# EAGLE design Human Harp Player (EAGLE 7.1.0)
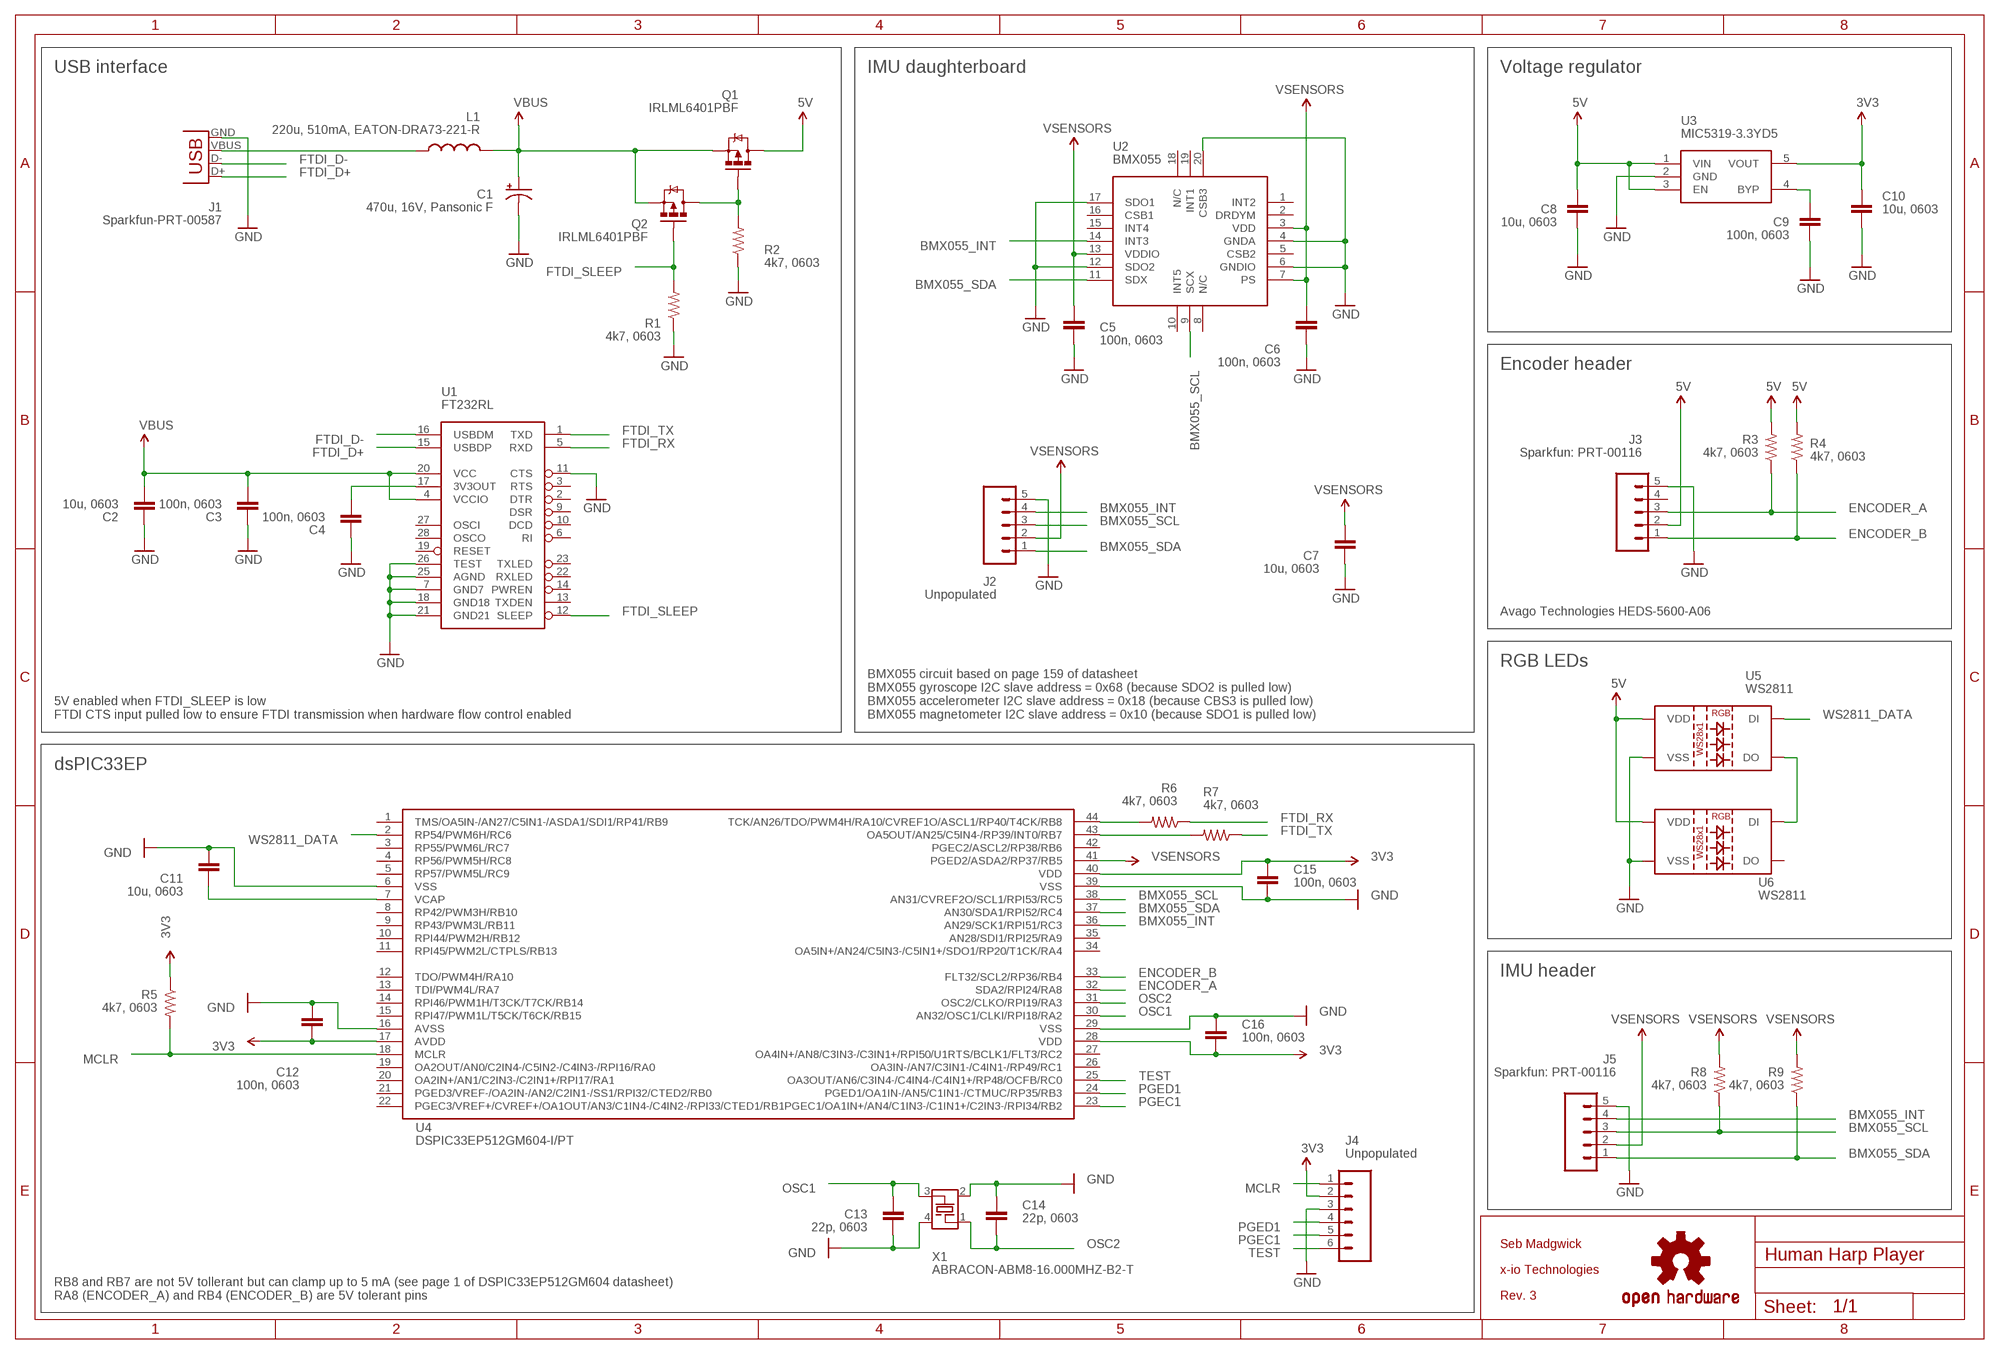
[diagram p0: schematic, sheet 1]

## Parts
C1  470u, 16V, Pansonic F  CPOL-USF  [PANASONIC_F]
C2  10u, 0603  CAP0402-CAP  [0402-CAP]
C3  100n, 0603  CAP0402-CAP  [0402-CAP]
C4  100n, 0603  CAP0402-CAP  [0402-CAP]
C5  100n, 0603  CAP0402-CAP  [0402-CAP]
C6  100n, 0603  CAP0402-CAP  [0402-CAP]
C7  10u, 0603  CAP0402-CAP  [0402-CAP]
C8  10u, 0603  CAP0402-CAP  [0402-CAP]
C9  100n, 0603  CAP0402-CAP  [0402-CAP]
C10  10u, 0603  CAP0402-CAP  [0402-CAP]
C11  10u, 0603  CAP0402-CAP  [0402-CAP]
C12  100n, 0603  CAP0402-CAP  [0402-CAP]
C13  22p, 0603  CAP0402-CAP  [0402-CAP]
C14  22p, 0603  CAP0402-CAP  [0402-CAP]
C15  100n, 0603  CAP0402-CAP  [0402-CAP]
C16  100n, 0603  CAP0402-CAP  [0402-CAP]
J1  Sparkfun-PRT-00587  USBSMD  [USB-MINIB]
J2  Unpopulated  M05PTH  [1X05]
J3  Sparkfun: PRT-00116  M05PTH  [1X05]
J4  Unpopulated  M06NO_SILK  [1X06_NO_SILK]
J5  Sparkfun: PRT-00116  M05PTH  [1X05]
L1  220u, 510mA, EATON-DRA73-221-R  L-USPIS2816  [PIS2816]
LOGO1  OSHW-LOGOL  [OSHW-LOGO-L]
Q1  IRLML6401PBF  MOSFET-PCHANNEL  [SOT23-3]
Q2  IRLML6401PBF  MOSFET-PCHANNEL  [SOT23-3]
R1  4k7, 0603  RESISTOR0402-RES  [0402-RES]
R2  4k7, 0603  RESISTOR0402-RES  [0402-RES]
R3  4k7, 0603  RESISTOR0402-RES  [0402-RES]
R4  4k7, 0603  RESISTOR0402-RES  [0402-RES]
R5  4k7, 0603  RESISTOR0402-RES  [0402-RES]
R6  4k7, 0603  RESISTOR0402-RES  [0402-RES]
R7  4k7, 0603  RESISTOR0402-RES  [0402-RES]
R8  4k7, 0603  RESISTOR0402-RES  [0402-RES]
R9  4k7, 0603  RESISTOR0402-RES  [0402-RES]
U1  FT232RL  FT232RLSSOP  [SSOP28DB]
U2  BMX055  [BMX055]
U3  MIC5319-3.3YD5  MIC5319  [SOT23-5]
U4  DSPIC33EP512GM604-I/PT  DSPIC33EP512GM604  [TQFP44]
U5  WS2811  LED-TRICOLOR-5050-ICWS2811  [LED-TRICOLOR-5050-IC]
U6  WS2811  LED-TRICOLOR-5050-ICWS2811  [LED-TRICOLOR-5050-IC]
X1  ABRACON-ABM8-16.000MHZ-B2-T  ABM8  [ABM8]

## Nets
3V3: C10.1 C12.1 C15.1 C16.2 J4.2 R5.1 U3.5(VOUT) U4.17(AVDD) U4.28(VDD) U4.40(VDD)
5V: C8.1 J3.2 Q1.3(D) R3.2 R4.2 U3.1(VIN) U3.3(EN) U5.3(VDD) U5.5(VDD) U6.3(VDD) U6.5(VDD)
BMX055_INT: J2.4 J5.4 U2.14(INT3) U4.36(AN29/SCK1/RPI51/RC3)
BMX055_SCL: J2.3 J5.3 R8.1 U2.9(SCX) U4.38(AN31/CVREF2O/SCL1/RPI53/RC5)
BMX055_SDA: J2.1 J5.1 R9.1 U2.11(SDX) U4.37(AN30/SDA1/RPI52/RC4)
ENCODER_A: J3.3 R3.1 U4.32(SDA2/RPI24/RA8)
ENCODER_B: J3.1 R4.1 U4.33(FLT32/SCL2/RP36/RB4)
FTDI_D+: J1.D+ U1.15(USBDP)
FTDI_D-: J1.D- U1.16(USBDM)
FTDI_RX: R6.1 U1.5(RXD)
FTDI_SLEEP: Q2.1(G) R1.2 U1.12(SLEEP)
FTDI_TX: R7.1 U1.1(TXD)
GND: C1.- C2.1 C3.1 C4.1 C5.2 C6.2 C7.1 C8.2 C9.2 C10.2 C11.2 C12.2 C13.1 C14.1 C15.2 C16.1 J1.GND J2.5 J3.5 J4.3 J5.5 R1.1 R2.1 U1.7(GND7) U1.11(CTS) U1.18(GND18) U1.21(GND21) U1.25(AGND) U1.26(TEST) U2.4(GNDA) U2.6(GNDIO) U2.12(SDO2) U2.17(SDO1) U2.20(CSB3) U3.2(GND) U4.6(VSS) U4.16(AVSS) U4.29(VSS) U4.39(VSS) U5.6(VSS) U6.6(VSS) X1.2 X1.4
MCLR: J4.1 R5.2 U4.18(MCLR)
N$1: Q1.1(G) Q2.3(D) R2.2
N$2: R6.2 U4.44(TCK/AN26/TDO/PWM4H/RA10/CVREF1O/ASCL1/RP40/T4CK/RB8)
N$3: C4.2 U1.17(3V3OUT)
N$4: C11.1 U4.7(VCAP)
N$5: R7.2 U4.43(OA5OUT/AN25/C5IN4-/RP39/INT0/RB7)
N$6: J1.VBUS L1.1
N$7: C9.1 U3.4(BYP)
N$8: U5.1(DO) U6.2(DI)
OSC1: C13.2 U4.30(AN32/OSC1/CLKI/RPI18/RA2) X1.3
OSC2: C14.2 U4.31(OSC2/CLKO/RPI19/RA3) X1.1
PGEC1: J4.5 U4.23(PGEC1/OA1IN+/AN4/C1IN3-/C1IN1+/C2IN3-/RPI34/RB2)
PGED1: J4.4 U4.24(PGED1/OA1IN-/AN5/C1IN1-/CTMUC/RP35/RB3)
TEST: J4.6 U4.25(OA3OUT/AN6/C3IN4-/C4IN4-/C4IN1+/RP48/OCFB/RC0)
VBUS: C1.+ C2.2 C3.2 L1.2 Q1.2(S) Q2.2(S) U1.4(VCCIO) U1.20(VCC)
VSENSORS: C5.1 C6.1 C7.2 J2.2 J5.2 R8.2 R9.2 U2.3(VDD) U2.7(PS) U2.13(VDDIO) U4.41(PGED2/ASDA2/RP37/RB5)
WS2811_DATA: U4.2(RP54/PWM6H/RC6) U5.2(DI)
Unconnected: J3.4 U1.2(DTR) U1.3(RTS) U1.6(RI) U1.9(DSR) U1.10(DCD) U1.13(TXDEN) U1.14(PWREN) U1.19(RESET) U1.22(RXLED) U1.23(TXLED) U1.27(OSCI) U1.28(OSCO) U2.1(INT2) U2.2(DRDYM) U2.5(CSB2) U2.8(N/C) U2.10(INT5) U2.15(INT4) U2.16(CSB1) U2.18(N/C) U2.19(INT1) U4.1(TMS/OA5IN-/AN27/C5IN1-/ASDA1/SDI1/RP41/RB9) U4.3(RP55/PWM6L/RC7) U4.4(RP56/PWM5H/RC8) U4.5(RP57/PWM5L/RC9) U4.8(RP42/PWM3H/RB10) U4.9(RP43/PWM3L/RB11) U4.10(RPI44/PWM2H/RB12) U4.11(RPI45/PWM2L/CTPLS/RB13) U4.12(TDO/PWM4H/RA10) U4.13(TDI/PWM4L/RA7) U4.14(RPI46/PWM1H/T3CK/T7CK/RB14) U4.15(RPI47/PWM1L/T5CK/T6CK/RB15) U4.19(OA2OUT/AN0/C2IN4-/C5IN2-/C4IN3-/RPI16/RA0) U4.20(OA2IN+/AN1/C2IN3-/C2IN1+/RPI17/RA1) U4.21(PGED3/VREF-/OA2IN-/AN2/C2IN1-/SS1/RPI32/CTED2/RB0) U4.22(PGEC3/VREF+/CVREF+/OA1OUT/AN3/C1IN4-/C4IN2-/RPI33/CTED1/RB1) U4.26(OA3IN-/AN7/C3IN1-/C4IN1-/RP49/RC1) U4.27(OA4IN+/AN8/C3IN3-/C3IN1+/RPI50/U1RTS/BCLK1/FLT3/RC2) U4.34(OA5IN+/AN24/C5IN3-/C5IN1+/SDO1/RP20/T1CK/RA4) U4.35(AN28/SDI1/RPI25/RA9) U4.42(PGEC2/ASCL2/RP38/RB6) U6.1(DO)

## Notes on the sheet
- USB interface | IMU daughterboard | Voltage regulator
- Encoder header
- Avago Technologies HEDS-5600-A06
- RGB LEDs
- 5V enabled when FTDI_SLEEP is low
  FTDI CTS input pulled low to ensure FTDI transmission when hardware flow control enabled
- BMX055 circuit based on page 159 of datasheet
  BMX055 gyroscope I2C slave address = 0x68 (because SDO2 is pulled low)
  BMX055 accelerometer I2C slave address = 0x18 (because CBS3 is pulled low)
  BMX055 magnetometer I2C slave address = 0x10 (because SDO1 is pulled low)
- dsPIC33EP
- IMU header
- Seb Madgwick
- x-io Technologies
- RB8 and RB7 are not 5V tollerant but can clamp up to 5 mA (see page 1 of DSPIC33EP512GM604 datasheet)
  RA8 (ENCODER_A) and RB4 (ENCODER_B) are 5V tolerant pins
- Rev. 3

## Library data of the parts
C1 = rcl:CPOL-US: POLARIZED CAPACITOR, American symbol
C2-C16 = SparkFun:CAP: Capacitor Standard 0603 ceramic capacitor, and 0.1" leaded capacitor.
J1 = SparkFun-Connectors:USB: USB Connectors USB-B-PTH is fully proven SKU : PRT-00139/CONN-08278 USB-miniB is fully proven SKU : PRT-00587 USB-A-PCB is untested. USB-A-H is throughly reviewed, but untested. Spark Fun Electronics SKU : PRT-00437 USB-B-SMT is throughly reviewed, but untested. Needs silkscreen touching up. USB-A-S has not been used/tested USB-MB-H has not been used/tested USB-MICROB has been used. CONN-09505; PROD_ID: CONN-08193
J2 J3 J5 = SparkFun-Connectors:M05: Header 5 Standard 5-pin 0.1" header. Use with straight break away headers (SKU : PRT-00116), right angle break away headers (PRT-00553), swiss pins (PRT-00743), machine pins (PRT-00117), and female headers (PRT-00115). Molex polarized connector foot print use with SKU : PRT-08230 with associated crimp pins and housings.
J4 = SparkFun-Connectors:M06: Header 6 Standard 6-pin 0.1" header. Use with straight break away headers (SKU : PRT-00116), right angle break away headers (PRT-00553), swiss pins (PRT-00743), machine pins (PRT-00117), and female headers (PRT-00115). Molex polarized connector foot print use with SKU : PRT-08094 with associated crimp pins and housings. NOTES ON THE VARIANTS LOCK and LOCK_LONGPADS... This footprint was designed to help hold the alignment of a through-hole component (i.e. 6-pin header) while soldering it into place. You may notice that each hole has been shifted either up or down by 0.005 of an inch from it's more standard position (which is a perfectly straight line). This slight alteration caused the pins (the squares in the middle) to touch the edges of the holes. Because they are alternating, it causes a "brace" to hold the component in place. 0.005 has proven to be the perfect amount of "off-center" position when using our standard breakaway headers. Although looks a little odd when you look at the bare footprint, once you have a header in there, the alteration is very hard to notice. Also,if you push a header all the way into place, it is covered up entirely on the bottom side. This idea of altering the position of holes to aid alignment will be further integrated into the Sparkfun Library for other footprints. It can help hold any component with 3 or more connection pins.
L1 = rcl:L-US: INDUCTOR, American symbol
LOGO1 = SparkFun-Aesthetics:OSHW-LOGO: Open Source Hardware Logo This logo indicates the piece of hardware it is found on incorporates a OSHW license and/or adheres to the definition of open source hardware found here: http://freedomdefined.org/OSHW
Q1 Q2 = SparkFun-DiscreteSemi:MOSFET-PCHANNEL: Generic PMOSFET IRLML2244 - TRANS-11153 (SOT-23 -20V -4.3A) (1.Gate 2.Source 3.Drain) FQP27P06 - COM-10349 <http://www.sparkfun.com/products/10349> (TO-220 -60V -27A) (1.Gate 2.Source 3.Drain); PROD_ID: TRANS-08285
R1-R9 = SparkFun:RESISTOR: Resistor Basic schematic elements and footprints for 0603, 1206, and PTH 1/10th watt (small) resistors.
U1 = SparkFun:FT232RL: USB UART FT232RL 4th Generation USB UART (USB <-> Serial) Controller. Spark Fun Electronics SKU : COM-00650
U2 = x-io:BMX055
U3 = x-io:MIC5319
U4 = x-io:DSPIC33EP512GM604
U5 U6 = SparkFun-LED:LED-TRICOLOR-5050-IC: WS2812 RGB LED w/ WS2811 driver 5x5mm SMD LED with built-in controller IC. DIO-11598; PROD_ID: DIO-11598
X1 = x-io:ABM8

## Board
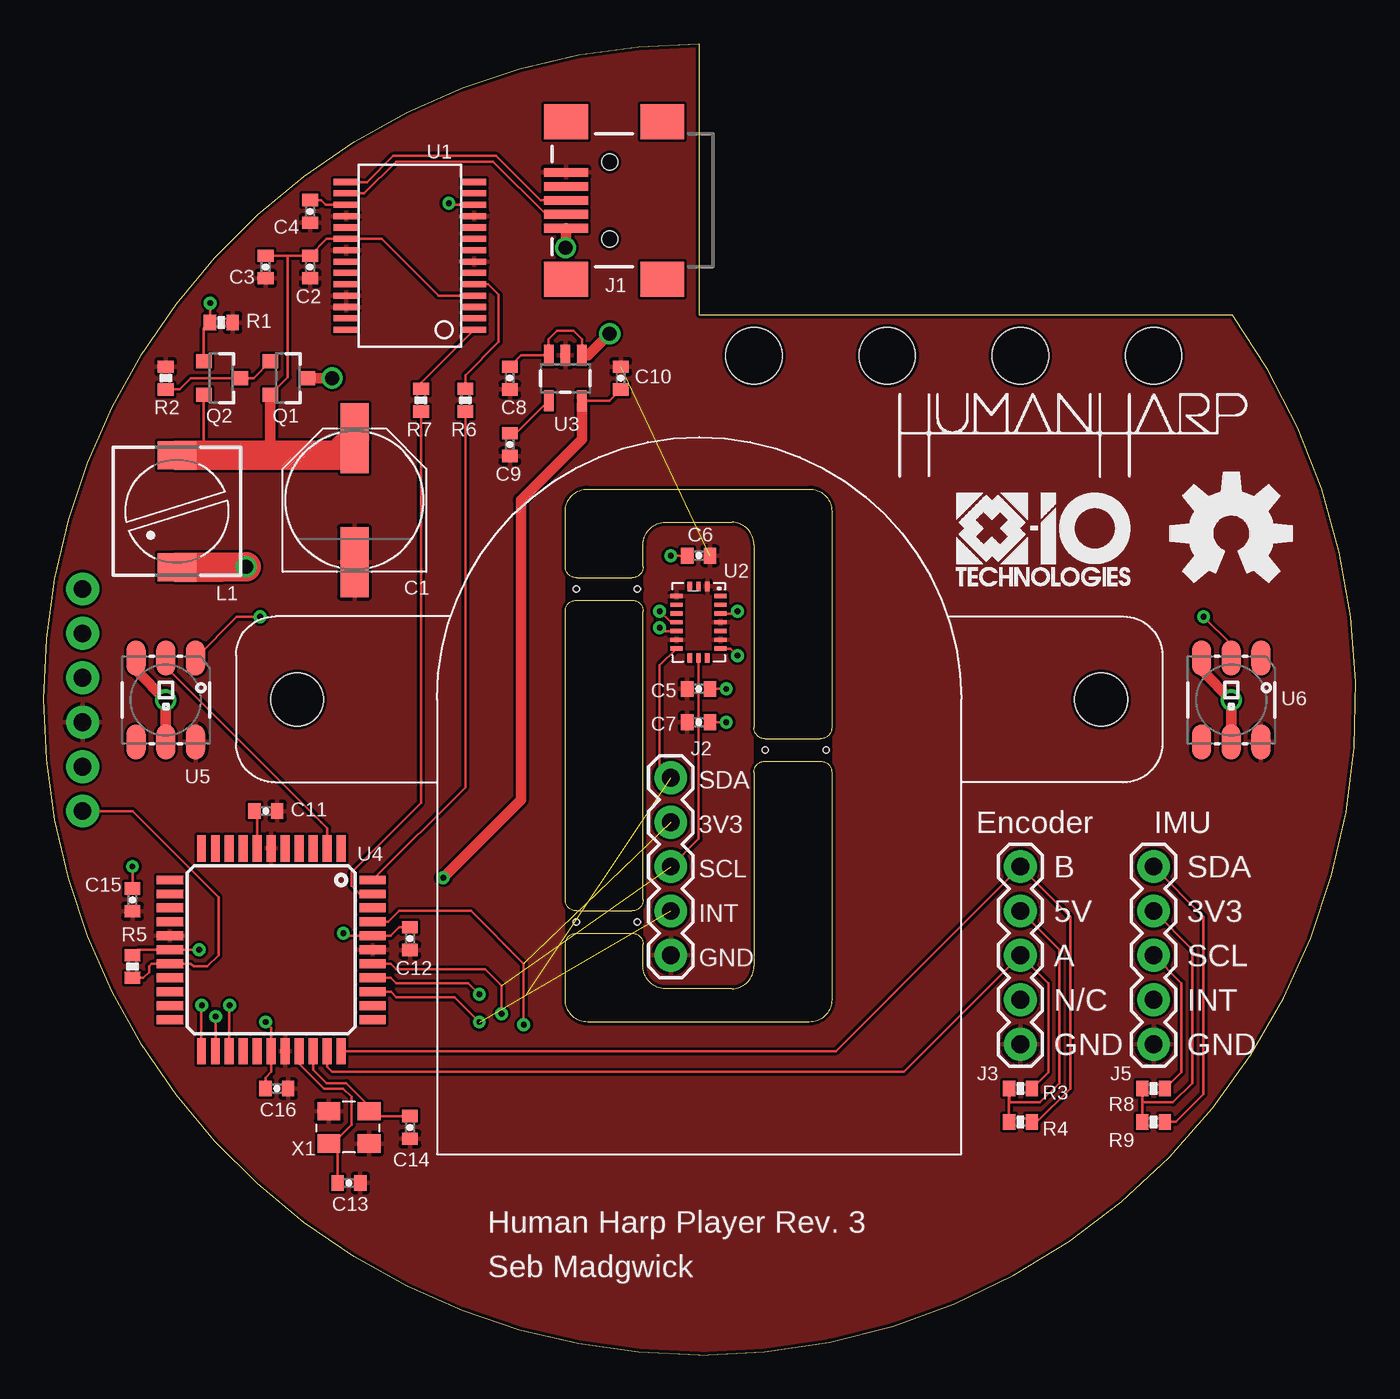
[diagram p1: board, top side]
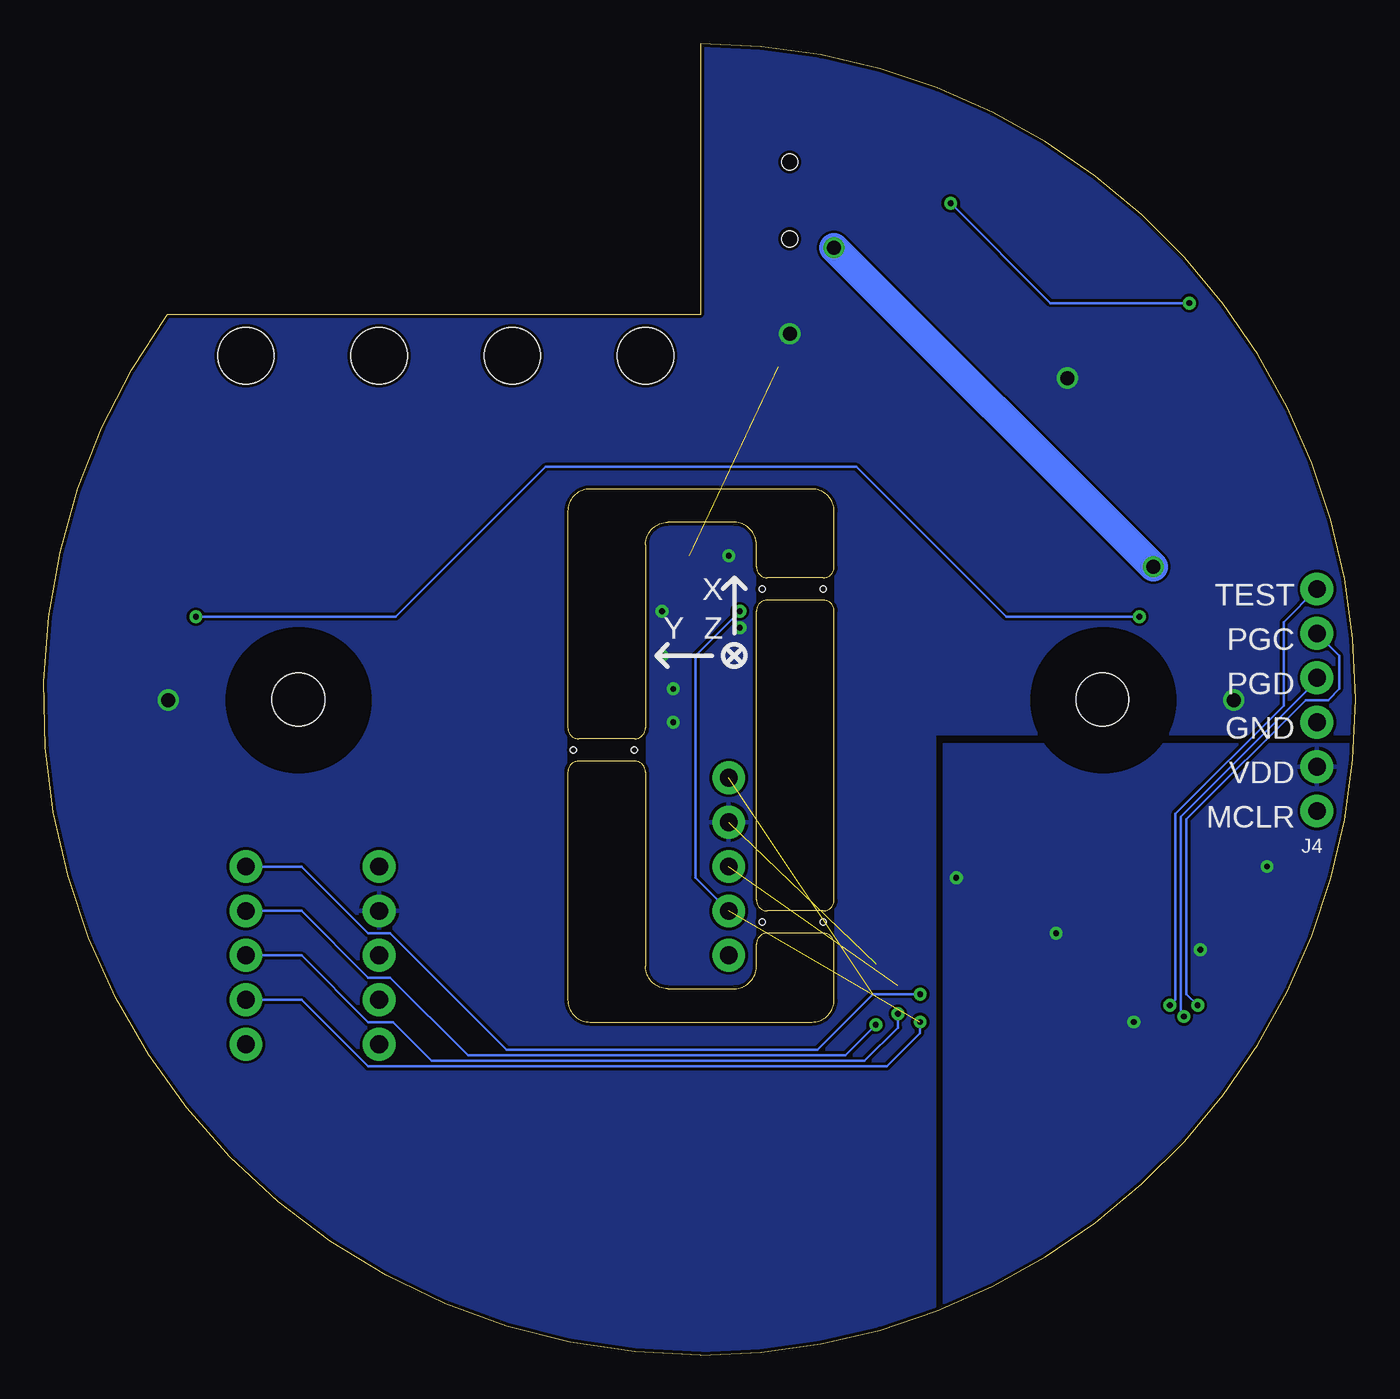
[diagram p2: board, bottom side, seen from below]

Size 75.07 x 75 mm. Coordinates in mm from the lower left corner, seen from the top.
Outline: 0,37.5 arc-90 37.5,75 37.5,59.5 68,59.5 arc-126 37.5,0 arc-90 0,37.5
Outline: 35.56,47.62 39.37,47.62 arc-90 40.64,46.35 40.64,35.88 arc90 41.27,35.24 44.45,35.24 arc90 45.09,35.88 45.09,48.26 arc90 43.81,49.53 31.11,49.53 arc90 29.84,48.26 29.84,45.09 arc90 30.48,44.45 33.66,44.45 arc90 34.29,45.09 34.29,46.35 arc-90 35.56,47.62
Outline: 40.64,33.34 40.64,22.23 arc-90 39.37,20.95 35.56,20.95 arc-90 34.29,22.23 34.29,23.5 arc90 33.66,24.13 30.48,24.13 arc90 29.84,23.5 29.84,20.32 arc90 31.11,19.05 43.81,19.05 arc90 45.09,20.32 45.09,33.34 arc90 44.45,33.97 41.27,33.97 arc90 40.64,33.34
Outline: 34.29,26.04 34.29,42.55 arc90 33.66,43.18 30.48,43.18 arc90 29.84,42.55 29.84,26.04 arc90 30.48,25.4 33.66,25.4 arc90 34.29,26.04
Copper layers (1*16): Top 0.035mm / dielectric 1.5mm / Bottom 0.035mm
Design rules "default *": minimum track width 6mil, minimum drill 13mil, track to track 6mil, track to pad 6mil, pad to pad 6mil, via to via 6mil, smd to smd 0.15mm, copper to edge 0.2mm, drill to drill 0.15mm, minimum pad ring 10mil, minimum via ring 8mil, stop-mask expansion 4mil, vias tented up to drill 1mm, thermal gap 0.195mm
Holes 3.2 mm at 40.64,57.15 48.26,57.15 55.88,57.15 63.5,57.15
Holes 0.33 mm at 30.48,24.77 41.27,34.61 33.97,43.81 30.48,43.81 33.97,24.77 44.77,34.61
tRestrict: area 40.6,33.3 to 45.1,35.9; area 29.8,23.5 to 34.3,45.1
bRestrict: area 40.6,33.3 to 45.1,35.9; area 29.8,23.5 to 34.3,45.1; area 10.5,33.5 to 18.4,41.4; area 56.5,33.5 to 64.5,41.4

### Footprints (pad centres in the part's own frame; a part is rotated, then mirrored left to right if it is on the bottom)
PANASONIC_F = smd 4 x 1.6: + 3.55,0; - -3.55,0
0402-CAP = smd 0.7 x 0.9: 1 -0.65,0; 2 0.65,0
USB-MINIB = smd 2.5 x 0.5: D+ 2.5,0; D- 2.5,0.8; GND 2.5,-1.6; ID 2.5,-0.8; VBUS 2.5,1.6 | smd 2.5 x 2: MTN1 -3,4.5; MTN2 2.5,4.5; MTN3 -3,-4.5; MTN4 2.5,-4.5 | hole 0.9: 0,2.2; 0,-2.2
1X05 = drill 1.016 pad 1.88: 1 0,0; 2 2.54,0; 3 5.08,0; 4 7.62,0; 5 10.16,0
1X06_NO_SILK = drill 1.016 pad 1.88: 1 0,0; 2 2.54,0; 3 5.08,0; 4 7.62,0; 5 10.16,0; 6 12.7,0
PIS2816 = smd 2.2 x 1.6: 1 0,3.2; 2 0,-3.2
SOT23-3 = smd 0.8 x 0.9: 1 -0.95,-1; 2 0.95,-1; 3 0,1.1
0402-RES = smd 0.7 x 0.9: 1 -0.65,0; 2 0.65,0
SSOP28DB = smd 0.348 x 1.397: 1 -4.225,-3.656; 2 -3.575,-3.656; 3 -2.925,-3.656; 4 -2.275,-3.656; 5 -1.625,-3.656; 6 -0.975,-3.656; 7 -0.325,-3.656; 8 0.325,-3.656; 9 0.975,-3.656; 10 1.625,-3.656; 11 2.275,-3.656; 12 2.925,-3.656; 13 3.575,-3.656; 14 4.225,-3.656; 15 4.225,3.656; 16 3.575,3.656; 17 2.925,3.656; 18 2.275,3.656; 19 1.625,3.656; 20 0.975,3.656; 21 0.325,3.656; 22 -0.325,3.656; 23 -0.975,3.656; 24 -1.625,3.656; 25 -2.275,3.656; 26 -2.925,3.656; 27 -3.575,3.656; 28 -4.225,3.656
BMX055 = smd 0.675 x 0.25: 1 1.262,1.5; 2 1.262,1; 3 1.262,0.5; 4 1.262,0; 5 1.262,-0.5; 6 1.262,-1; 7 1.262,-1.5; 11 -1.262,-1.5; 12 -1.262,-1; 13 -1.262,-0.5; 14 -1.262,0; 15 -1.262,0.5; 16 -1.262,1; 17 -1.262,1.5 | smd 0.25 x 0.55: 8 0.5,-2.05; 9 0,-2.05; 10 -0.5,-2.05; 18 -0.5,2.05; 19 0,2.05; 20 0.5,2.05
SOT23-5 = smd 0.55 x 1.2: 1 -0.95,-1.3; 2 0,-1.3; 3 0.95,-1.3; 4 0.95,1.3; 5 -0.95,1.3
TQFP44 = smd 1.5 x 0.5: 1 -5.8,4; 2 -5.8,3.2; 3 -5.8,2.4; 4 -5.8,1.6; 5 -5.8,0.8; 6 -5.8,0; 7 -5.8,-0.8; 8 -5.8,-1.6; 9 -5.8,-2.4; 10 -5.8,-3.2; 11 -5.8,-4; 23 5.8,-4; 24 5.8,-3.2; 25 5.8,-2.4; 26 5.8,-1.6; 27 5.8,-0.8; 28 5.8,0; 29 5.8,0.8; 30 5.8,1.6; 31 5.8,2.4; 32 5.8,3.2; 33 5.8,4 | smd 0.5 x 1.5: 12 -4,-5.8; 13 -3.2,-5.8; 14 -2.4,-5.8; 15 -1.6,-5.8; 16 -0.8,-5.8; 17 0,-5.8; 18 0.8,-5.8; 19 1.6,-5.8; 20 2.4,-5.8; 21 3.2,-5.8; 22 4,-5.8; 34 4,5.8; 35 3.2,5.8; 36 2.4,5.8; 37 1.6,5.8; 38 0.8,5.8; 39 0,5.8; 40 -0.8,5.8; 41 -1.6,5.8; 42 -2.4,5.8; 43 -3.2,5.8; 44 -4,5.8
LED-TRICOLOR-5050-IC = smd 2 x 1.1: 1 -2.4,1.7; 2 -2.4,0; 3 -2.4,-1.7; 4 2.4,-1.7; 5 2.4,0; 6 2.4,1.7
HEDS-5600-A06 = hole 3: -23,0; 23,0
ABM8 = smd 1.3 x 1.05: 1 -1.15,-0.925; 2 1.15,-0.925; 3 1.15,0.925; 4 -1.15,0.925

### Placement (x,y rotation side)
C1  17.78,48.9 90 top
C2  15.24,62.23 90 top
C3  12.7,62.23 90 top
C4  15.24,65.41 90 top
C5  37.47,38.1 180 top
C6  37.47,45.72 0 top
C7  37.47,36.2 0 top
C8  26.67,55.88 270 top
C9  26.67,52.07 270 top
C10  33.02,55.88 90 top
C11  12.7,31.11 0 top
C12  20.95,23.81 270 top
C13  17.46,9.84 180 top
C14  20.95,13.02 90 top
C15  5.08,26.04 270 top
C16  13.34,15.24 180 top
J1  32.38,66.04 180 top
J2  35.88,33.02 270 top
J3  55.88,27.94 270 top
J4  2.22,31.11 90 top
J5  63.5,27.94 270 top
L1  7.62,48.26 180 top
LOGO1  67.94,46.99 0 top
Q1  13.97,55.88 270 top
Q2  10.16,55.88 270 top
R1  10.16,59.05 180 top
R2  6.99,55.88 270 top
R3  55.88,15.24 180 top
R4  55.88,13.34 180 top
R5  5.08,22.23 270 top
R6  24.13,54.61 270 top
R7  21.59,54.61 270 top
R8  63.5,15.24 180 top
R9  63.5,13.34 180 top
U1  20.95,62.87 90 top
U2  37.47,41.91 0 top
U3  29.84,55.88 180 top
U4  13.02,23.18 270 top
U5  6.99,37.47 270 top
U6  67.94,37.47 270 top
U$1  [X-IO_TECHNOLOGIES_LOGO_10MM_TOP]  52.07,43.81 0 top
U$2  [HEDS-5600-A06]  37.5,37.5 0 top
U$4  [HUMAN_HARP_LOGO_20MM_TOP]  48.9,50.16 0 top
X1  17.46,13.02 180 top

### Tracks (layer width: path | path; a pad name or v marks a point on that pad's centre or on a via)
3V3  (via drill 0.33)
  Top 0.152: v12.7,19.05 13.02,18.73 U4.28 13.02,16.19 12.69,15.86 C16.2 | v17.14,24.13 17.3,23.98 U4.40 19.85,23.98 20.34,24.46 C12.1 | v8.89,23.18 U4.17 5.38,23.18 R5.1 | C15.1 v5.08,27.94 | U3.5 32.37,54.58 C10.1
  Top 0.61: U3.5 30.8,52.38 27.3,48.9 27.3,31.75 v22.86,27.3
  pour Bottom: 0,0.07 23.57,0.07 23.57,34.92 0,34.92
5V  (via drill 0.8)
  Top 0.152: U3.1 30.8,58.1 30.32,58.58 29.37,58.58 28.89,58.1 U3.3 27.32,57.18 C8.1 | J3.2 58.1,23.18 58.1,15.56 56.99,14.45 55.24,14.45 55.24,15.22 R3.2 R4.2
  Top 0.61: U5.3 5.29,39.16 v6.99,37.47 U5.5 | U6.5 v67.94,37.47 66.25,39.16 U6.3 | Q1.3 v16.51,55.88 | U3.1 31.14,57.18 v32.38,58.42
  pour Bottom: 0,35.56 24.13,35.56 24.13,0 75,0 75,75 0,75
BMX055_INT  (via drill 0.33)  (1 unrouted)
  Top 0.152: U4.36 19.86,20.78 20.16,20.48 23.5,20.48 v24.92,19.05 | U2.14 35.88,41.91 v35.24,42.55
  Bottom 0.152: J5.4 60.33,20.32 56.52,16.51 26.83,16.51 24.92,18.41 v24.92,19.05 | v35.24,42.55 37.78,40.01 37.78,27.3 J2.4
BMX055_SCL  (via drill 0.33)  (1 unrouted)
  Top 0.152: J5.3 65.09,21.27 65.09,16.18 R8.1 | U4.38 19.85,22.38 20.16,22.07 25.24,22.07 26.19,21.11 v26.19,19.53 | J2.3 37.47,29.53 U2.9
  Bottom 0.152: J5.3 60.33,22.86 56.52,19.05 55.09,19.05 52.86,16.83 28.1,16.83 26.19,18.73 v26.19,19.53
BMX055_SDA  (via drill 0.33)  (1 unrouted)
  Top 0.152: J5.1 66.36,25.08 66.36,14.92 64.77,13.34 R9.1 | U4.37 19.86,21.58 20.16,21.27 24.29,21.27 v24.92,20.64 | U2.11 35.24,39.45 35.24,33.66 J2.1
  Bottom 0.152: J5.1 60.33,27.94 56.52,24.13 55.24,24.13 48.58,17.46 30.8,17.46 27.62,20.64 v24.92,20.64
ENCODER_A
  Top 0.152: R3.1 57.47,16.18 57.47,21.27 J3.3 49.21,16.19 16.51,16.19 16.22,16.48 U4.32
ENCODER_B
  Top 0.152: U4.33 45.32,17.38 J3.1 58.74,25.08 58.74,15.22 56.83,13.34 R4.1
FTDI_D+
  Top 0.152: J1.D+ 28.42,66.04 25.88,68.58 20,68.58 18.51,67.09 U1.15
FTDI_D-
  Top 0.152: J1.D- 28.74,65.24 25.72,68.26 20.16,68.26 18.34,66.44 U1.16
FTDI_RX
  Top 0.152: U1.5 25.44,61.24 26.04,60.64 26.04,57.94 24.13,56.04 R6.1
FTDI_SLEEP  (via drill 0.33)
  Top 0.152: Q2.1 9.16,58.7 R1.2 9.53,59.07 v9.53,60.17 | U1.12 23.27,65.79 v23.18,65.88
  Bottom 0.152: v9.53,60.17 17.46,60.17 v23.18,65.88
FTDI_TX
  Top 0.152: R7.1 21.59,55.62 U1.1
GND  (1 unrouted)
  pour Top: 0,0 75,0 75,75 0,75
MCLR
  Top 0.152: R5.2 5.7,21.57 6.03,21.91 6.03,22.23 6.18,22.38 U4.18 8.42,22.38 8.57,22.23 9.37,22.23 10,22.86 10,26.19 5.08,31.11 J4.1
N$1
  Top 0.152: Q1.1 12.02,55.88 Q2.3 8.41,55.88 7.78,55.24 7,55.24 R2.2
N$2
  Top 0.152: U4.44 24.13,32.49 R6.2
N$3
  Top 0.152: U1.17 16.12,65.79 15.86,66.06 C4.2
N$4
  Top 0.152: U4.7 12.22,30.95 C11.1
N$5
  Top 0.152: U4.43 18.07,26.38 17.62,26.83 17.62,27.62 21.59,31.59 R7.2
N$6  (via drill 0.8)
  Top 0.61: J1.VBUS 29.89,63.38 v29.84,63.34
  Top 1.676: v11.59,45.09 10.13,45.06 L1.1
  Bottom 1.676: v29.84,63.34 v11.59,45.09
N$7
  Top 0.152: C9.1 27.04,52.72 U3.4
N$8  (via drill 0.33)
  Top 0.152: v66.36,42.23 67.94,40.64 U6.2 | U5.1 11.05,42.23 v12.38,42.23
  Bottom 0.152: v12.38,42.23 20,42.23 28.57,50.8 46.35,50.8 54.93,42.23 v66.36,42.23
OSC1
  Top 0.152: U4.30 14.62,16.66 16.03,15.24 17.14,15.24 17.62,14.76 17.62,13.18 16.54,12.09 X1.3 16.81,11.59 C13.2
OSC2
  Top 0.152: U4.31 15.42,16.33 16.19,15.56 17.32,15.56 18.57,14.29 18.61,14.09 X1.1 18.89,13.67 C14.2
PGEC1  (via drill 0.33)
  Top 0.152: U4.23 9.02,20.13 v9.05,20
  Bottom 0.152: J4.5 0.95,40.01 0.95,38.1 1.59,37.47 2.86,37.47 9.68,30.64 9.68,20.64 v9.05,20
PGED1  (via drill 0.33)
  Top 0.152: U4.24 9.84,17.4 v9.84,19.37
  Bottom 0.152: v9.84,19.37 10,19.53 10,30.8 2.22,38.58 J4.4
TEST  (via drill 0.33)
  Top 0.152: U4.25 10.62,19.98 v10.64,20
  Bottom 0.152: v10.64,20 10.32,20.32 10.32,30.96 4.13,37.15 4.13,41.91 J4.6
VBUS
  Top 0.152: Q2.2 9.16,51.73 | Q1.2 13.97,55.93 13.97,62.87 | C3.2 13.96,62.88 13.97,62.87 | 13.97,62.87 15.22,62.87 C2.2 16.2,63.84 U1.20 19.34,63.84 22.59,60.59 U1.4
  Top 0.61: 9.16,51.73 8.89,51.46 | Q1.2 12.97,51.57 12.86,51.46
  Top 1.676: L1.2 8.89,51.46 12.86,51.46 16.8,51.46 C1.+
VSENSORS  (via drill 0.33)  (1 unrouted)
  Top 0.152: U2.13 35.42,41.41 v35.24,41.59 | C7.2 v39.05,36.2 | C5.1 v39.05,38.1 | U2.7 39.28,40.41 v39.69,40.01 | U2.3 39.55,42.41 v39.69,42.55 | C6.1 v35.88,45.72 | J5.2 65.72,23.18 65.72,15.56 64.61,14.45 62.85,14.45 | R9.2 62.85,14.45 | 62.85,14.45 R8.2 | U4.41 19.7,24.78 20.32,25.4 24.45,25.4 27.46,22.38 v27.46,18.89
  Bottom 0.152: v27.46,18.89 29.21,17.14 50.8,17.14 55.24,21.59 56.52,21.59 60.33,25.4 J5.2
  pour Bottom: 34.29,47.62 40.64,47.62 40.64,20.95 34.29,20.95
WS2811_DATA
  Top 0.152: U5.2 6.99,39.37 15.56,30.8 15.88,30.48 16.22,30.14 U4.2

### Text on the board
_tsilk: SDA | 3V3 | Encoder | IMU | SCL | B | SDA | INT | 5V | 3V3 | GND | A | SCL | N/C | INT | GND | GND | Human Harp Player Rev. 3 | Seb Madgwick
_bsilk: TEST | X | PGC | Z | Y | PGD | GND | VDD | MCLR